# Altium schematic sheet LedArray.SchDoc
size A3
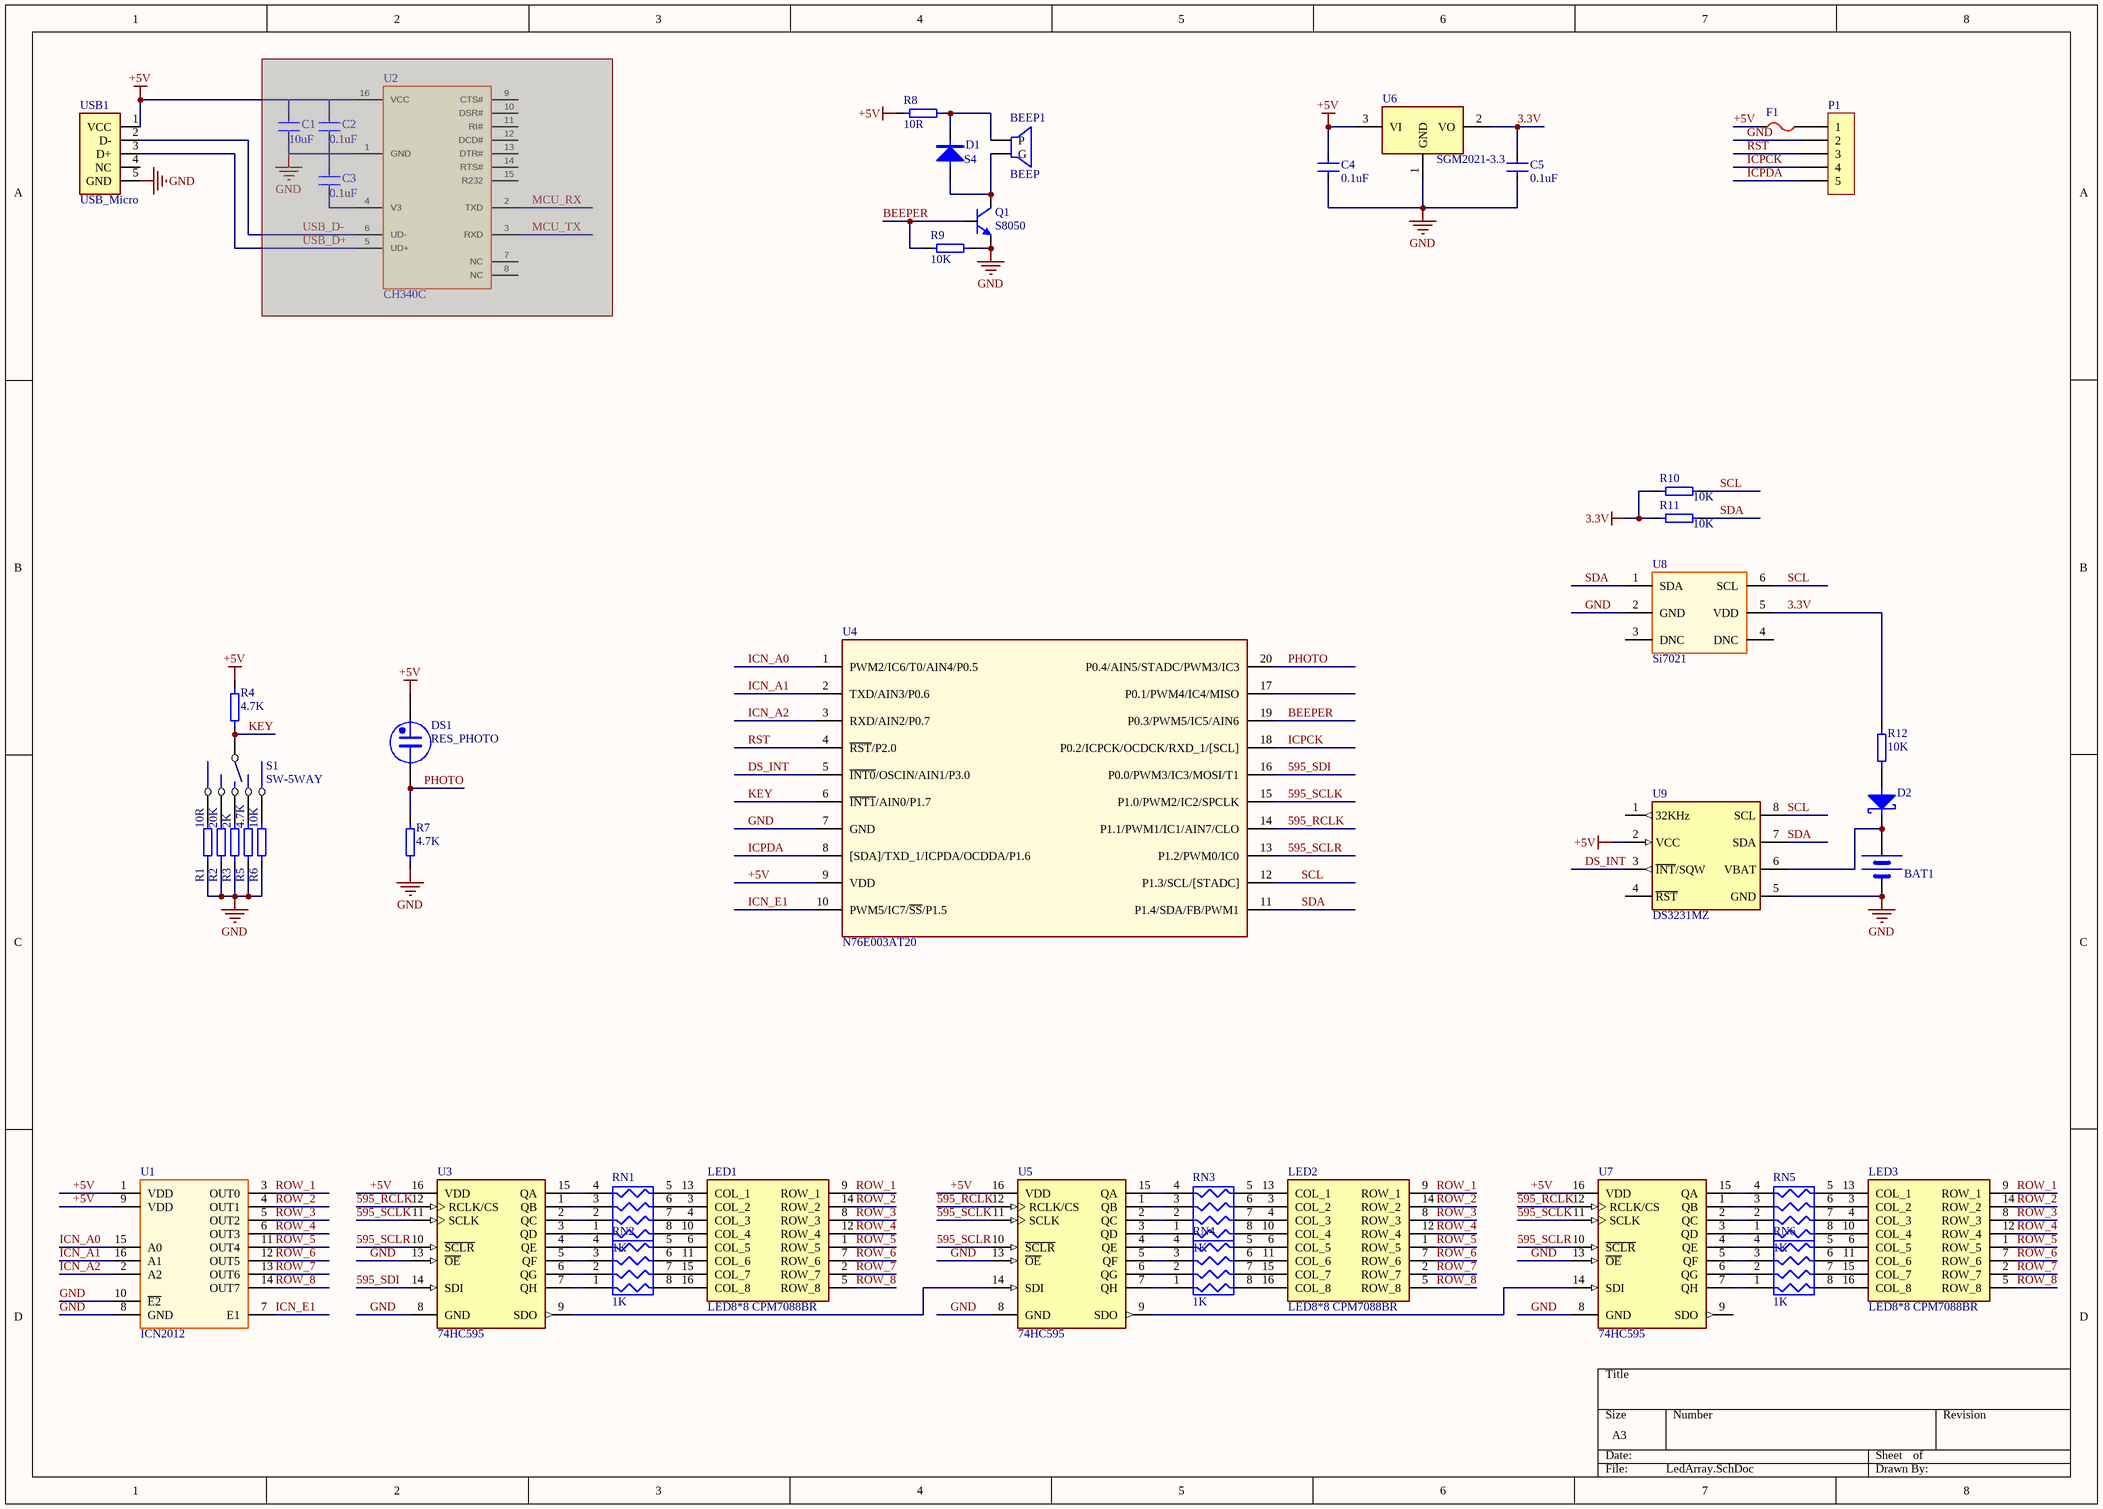
[diagram p0: LedArray.SchDoc]

## Parts
BAT1  BATT  [BATTERY1]  (value not drawn)
BEEP1  BEEP  [蜂鸣器 9*5mm]
C1  10uF  [0805C]  (masked out: inside a compile mask, not in the netlist)
C2  0.1uF  [0805C]  (masked out: inside a compile mask, not in the netlist)
C3  0.1uF  [0805C]  (masked out: inside a compile mask, not in the netlist)
C4  0.1uF  [0603C]
C5  0.1uF  [0603C]
D1  S4  [SOD-323F]
D2  (no value)  [SOD-123]
DS1  RES_PHOTO  [LDR]
F1  FUSE  [0805FZ]  (value not drawn)
LED1  LED8*8 CPM7088BR  [LED8*8 CPM7088BR]
LED2  LED8*8 CPM7088BR  [LED8*8 CPM7088BR]
LED3  LED8*8 CPM7088BR  [LED8*8 CPM7088BR]
P1  CON5  [SMT_1.25W-5P]  (value not drawn)
Q1  S8050  [SOT-23]
R1  10R  [0603R]
R2  20K  [0603R]
R3  2K  [0603R]
R4  4.7K  [0603R]
R5  4.7K  [0603R]
R6  10K  [0603R]
R7  4.7K  [0603R]
R8  10R  [0805R]
R9  10K  [0603R]
R10  10K  [0603R]
R11  10K  [0603R]
R12  10K  [0603R]
RN1  1K  [0603*4]
RN2  1K  [0603*4]
RN3  1K  [0603*4]
RN4  1K  [0603*4]
RN5  1K  [0603*4]
RN6  1K  [0603*4]
S1  SW-5WAY  [SW_5WAY]
U1  ICN2012  [SOIC-16N]
U2  CH340C  [SOIC-16N]  (masked out: inside a compile mask, not in the netlist)
U3  74HC595  [TSSOP16]
U4  N76E003AT20  [TSSOP20]
U5  74HC595  [TSSOP16]
U6  SGM2021-3.3  [SOT-23]
U7  74HC595  [TSSOP16]
U8  Si7021  [QFN-6]
U9  DS3231MZ  [SOIC-8]
USB1  USB_Micro  [USB_Micro-A]

## Nets
3.3V: C5.1 R10.1 R11.1 R12.2 U6.2(VO) U8.5(VDD)
+5V: C4.1 DS1.1 F1.1 R4.2 R8.2 U1.1(VDD) U1.9(VDD) U3.16(VDD) U4.9(VDD) U5.16(VDD) U6.3(VI) U7.16(VDD) U9.2(VCC) USB1.1(VCC)
GND: BAT1.2(GND) C4.2 C5.2 P1.2 Q1.2(E) R1.1 R2.1 R3.1 R5.1 R6.1 R7.1 R9.2 U1.8(GND) U1.10(~{E2}) U3.8(GND) U3.13(~{OE}) U4.7(GND) U5.8(GND) U5.13(~{OE}) U6.1(GND) U7.8(GND) U7.13(~{OE}) U8.2(GND) U9.5(GND) USB1.5(GND)
595_RCLK: U3.12(RCLK/CS) U4.14(P1.1/PWM1/IC1/AIN7/CLO) U5.12(RCLK/CS) U7.12(RCLK/CS)
595_SCLK: U3.11(SCLK) U4.15(P1.0/PWM2/IC2/SPCLK) U5.11(SCLK) U7.11(SCLK)
595_SCLR: U3.10(~{SCLR}) U4.13(P1.2/PWM0/IC0) U5.10(~{SCLR}) U7.10(~{SCLR})
595_SDI: U3.14(SDI) U4.16(P0.0/PWM3/IC3/MOSI/T1)
BEEPER: Q1.1(B) R9.1 U4.19(P0.3/PWM5/IC5/AIN6)
DS_INT: U4.5(~{INT0}/OSCIN/AIN1/P3.0) U9.3(~{INT}/SQW)
ICN_A0: U1.15(A0) U4.1(PWM2/IC6/T0/AIN4/P0.5)
ICN_A1: U1.16(A1) U4.2(TXD/AIN3/P0.6)
ICN_A2: U1.2(A2) U4.3(RXD/AIN2/P0.7)
ICN_E1: U1.7(E1) U4.10(PWM5/IC7/~{SS}/P1.5)
ICPCK: P1.4 U4.18(P0.2/ICPCK/OCDCK/RXD_1/[SCL])
ICPDA: P1.5 U4.8([SDA]/TXD_1/ICPDA/OCDDA/P1.6)
KEY: R4.1 S1.5 U4.6(~{INT1}/AIN0/P1.7)
PHOTO: DS1.2 R7.2 U4.20(P0.4/AIN5/STADC/PWM3/IC3)
ROW_1: LED1.9(ROW_1) LED2.9(ROW_1) LED3.9(ROW_1) U1.3(OUT0)
ROW_2: LED1.14(ROW_2) LED2.14(ROW_2) LED3.14(ROW_2) U1.4(OUT1)
ROW_3: LED1.8(ROW_3) LED2.8(ROW_3) LED3.8(ROW_3) U1.5(OUT2)
ROW_4: LED1.12(ROW_4) LED2.12(ROW_4) LED3.12(ROW_4) U1.6(OUT3)
ROW_5: LED1.1(ROW_5) LED2.1(ROW_5) LED3.1(ROW_5) U1.11(OUT4)
ROW_6: LED1.7(ROW_6) LED2.7(ROW_6) LED3.7(ROW_6) U1.12(OUT5)
ROW_7: LED1.2(ROW_7) LED2.2(ROW_7) LED3.2(ROW_7) U1.13(OUT6)
ROW_8: LED1.5(ROW_8) LED2.5(ROW_8) LED3.5(ROW_8) U1.14(OUT7)
RST: P1.3 U4.4(~{RST}/P2.0)
SCL: R10.2 U4.12(P1.3/SCL/[STADC]) U8.6(SCL) U9.8(SCL)
SDA: R11.2 U4.11(P1.4/SDA/FB/PWM1) U8.1(SDA) U9.7(SDA)
NetBAT1_1: BAT1.1(VCC) D2.2(K) U9.6(VBAT)
NetBEEP1_1: BEEP1.1(P) D1.2(K) R8.1
NetBEEP1_2: BEEP1.2(G) D1.1(A) Q1.3(C)
NetD2_1: D2.1(A) R12.1
NetF1_2: F1.2 P1.1
NetLED1_3: LED1.3(COL_2) RN1.6
NetLED1_4: LED1.4(COL_3) RN1.7
NetLED1_6: LED1.6(COL_5) RN2.5
NetLED1_10: LED1.10(COL_4) RN1.8
NetLED1_11: LED1.11(COL_6) RN2.6
NetLED1_13: LED1.13(COL_1) RN1.5
NetLED1_15: LED1.15(COL_7) RN2.7
NetLED1_16: LED1.16(COL_8) RN2.8
NetLED2_3: LED2.3(COL_2) RN3.6
NetLED2_4: LED2.4(COL_3) RN3.7
NetLED2_6: LED2.6(COL_5) RN4.5
NetLED2_10: LED2.10(COL_4) RN3.8
NetLED2_11: LED2.11(COL_6) RN4.6
NetLED2_13: LED2.13(COL_1) RN3.5
NetLED2_15: LED2.15(COL_7) RN4.7
NetLED2_16: LED2.16(COL_8) RN4.8
NetLED3_3: LED3.3(COL_2) RN5.6
NetLED3_4: LED3.4(COL_3) RN5.7
NetLED3_6: LED3.6(COL_5) RN6.5
NetLED3_10: LED3.10(COL_4) RN5.8
NetLED3_11: LED3.11(COL_6) RN6.6
NetLED3_13: LED3.13(COL_1) RN5.5
NetLED3_15: LED3.15(COL_7) RN6.7
NetLED3_16: LED3.16(COL_8) RN6.8
NetR1_2: R1.2 S1.1
NetR2_2: R2.2 S1.6
NetR3_2: R3.2 S1.2
NetR5_2: R5.2 S1.3
NetR6_2: R6.2 S1.4
NetRN1_1: RN1.1 U3.3(QD)
NetRN1_2: RN1.2 U3.2(QC)
NetRN1_3: RN1.3 U3.1(QB)
NetRN1_4: RN1.4 U3.15(QA)
NetRN2_1: RN2.1 U3.7(QH)
NetRN2_2: RN2.2 U3.6(QG)
NetRN2_3: RN2.3 U3.5(QF)
NetRN2_4: RN2.4 U3.4(QE)
NetRN3_1: RN3.1 U5.3(QD)
NetRN3_2: RN3.2 U5.2(QC)
NetRN3_3: RN3.3 U5.1(QB)
NetRN3_4: RN3.4 U5.15(QA)
NetRN4_1: RN4.1 U5.7(QH)
NetRN4_2: RN4.2 U5.6(QG)
NetRN4_3: RN4.3 U5.5(QF)
NetRN4_4: RN4.4 U5.4(QE)
NetRN5_1: RN5.1 U7.3(QD)
NetRN5_2: RN5.2 U7.2(QC)
NetRN5_3: RN5.3 U7.1(QB)
NetRN5_4: RN5.4 U7.15(QA)
NetRN6_1: RN6.1 U7.7(QH)
NetRN6_2: RN6.2 U7.6(QG)
NetRN6_3: RN6.3 U7.5(QF)
NetRN6_4: RN6.4 U7.4(QE)
NetU3_9: U3.9(SDO) U5.14(SDI)
NetU5_9: U5.9(SDO) U7.14(SDI)

Not connected (* = marked no-connect by the designer): U4 17(P0.1/PWM4/IC4/MISO); U7 9(SDO); U8 3(DNC) 4(DNC); U9 1(32KHz) 4(~{RST}); USB1 2(D-) 3(D+) 4(NC)

## Library data of the parts
BAT1 = PWR_BAT
BEEP1 = BEEP: 发声器件
C1-C5 = CAP
D1 = DIODE
D2 = DIODE SCHOTTKY: Schottky Diode
Q1 = NPN: 贴片 S8050/S9013/MMBT3904
R1-R12 = RES: RESISTOR; 电阻贴片: 0R; 电阻贴片: 1K
RN1-RN6 = RES_PACK-4: 排阻贴片: 0R; 排阻贴片: 10K; 排阻贴片: 1K
U1 = ICN2012: LED 行驱动
U2 = CH340C: USB2UART
U3 U5 U7 = 74HC595: 移位寄存器; ComponentAvailability: Not for New Design; Published: 15-Apr-2002; LatestRevisionDate: 13-Apr-2006; LatestRevisionNote: IPC-7351 Footprint Added.; DatasheetVersion: 1997; PackageVersion: 1997; PackageReference: 966-01; Publisher: Altium Limited; PackageDescription: 16-Pin Small Outline Package 1.27 mm Pitch; ComponentLink1Description: Manufacturer Link; ComponentLink1URL: http://www.onsemi.com/; ComponentLink2Description: Datasheet; ComponentLink2URL: http://www.onsemi.com/pub/Collateral/MC74VHC595-D.PDF
U4 = N76E003AT20: Nuvoton MCU
U6 = SGM2021: 电源芯片 LDO; VO: 0.9V,1.2V,1.3V,1.5V,~~~5.0V
U8 = Si7021: 温湿度传感器
U9 = DS3231MZ: 时钟芯片;内置晶振、32.768K时钟输出、1Hz方波输出